# Altium schematic sheet Power.SchDoc
size A4; SheetNumber: 2; SheetTotal: 5
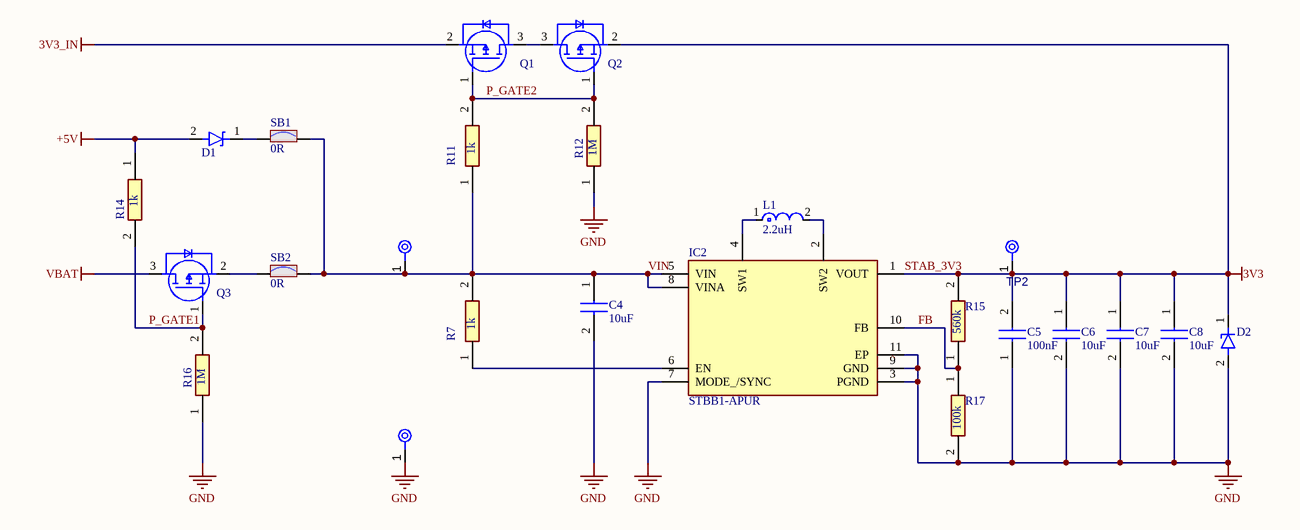
[diagram p0: Power.SchDoc]

## Parts
C4  10uF  [GRM18x]
C5  100nF  [CAPC1005X70N]
C6  10uF  [GRM18x]
C7  10uF  [GRM18x]
C8  10uF  [GRM18x]
D1  RB168MM-40TFTR  [RB168MM40TFTR]  (value not drawn)
D2  SP3205-01ETG  [SP320501ETG]  (value not drawn)
IC2  STBB1-APUR  [SON50P300X300X100-11N-D]
L1  2.2uH  [FP-XFL4020-MFG]
Q1  SSM3J358R,LF  [SOTFL95P240X88-3N]  (value not drawn)
Q2  SSM3J358R,LF  [SOTFL95P240X88-3N]  (value not drawn)
Q3  SSM3J358R,LF  [SOTFL95P240X88-3N]  (value not drawn)
R7  1k  [RESC1005X35N]
R11  1k  [RESC1005X35N]
R12  1M  [RESC1005X40N]
R14  1k  [RESC1005X35N]
R15  560k  [RESC1005X40N]
R16  1M  [RESC1005X40N]
R17  100k  [RESC1005X40N]
SB1  value 0R  [SOLDER-BRIDGE_R0603-0R]  (hidden comment: SB_ON)
SB2  value 0R  [SOLDER-BRIDGE_R0603-0R]  (hidden comment: SB_ON)
TP1  TPAD6R  [TP06R]  (value not drawn)  (no BOM)
TP2  TPAD6R  [TP06R]  (value not drawn)  (no BOM)
TP3  TPAD6R  [TP06R]  (value not drawn)  (no BOM)

## Nets
3V3_IN: Q1.2(S)
+5V: D1.2(A) R14.1
GND: C4.2 C5.1 C6.2 C7.2 C8.2 D2.2(A) IC2.3(PGND) IC2.7(MODE_/SYNC) IC2.9(GND) IC2.11(EP) R12.1 R16.1 R17.2 TP3.1(TP)
STAB_3V3: C5.2 C6.1 C7.1 C8.1 D2.1(K) IC2.1(VOUT) Q2.2(S) R15.2 TP2.1(TP)  [also labelled 3V3]
VBAT: Q3.3(D)
FB: IC2.10(FB) R15.1 R17.1
P_GATE1: Q3.1(G) R14.2 R16.2
P_GATE2: Q1.1(G) Q2.1(G) R11.2 R12.2
VIN: C4.1 IC2.5(VIN) IC2.8(VINA) R7.2 R11.1 SB1.2 SB2.2 TP1.1(TP)
NetD1_1: D1.1(K) SB1.1
NetIC2_2: IC2.2(SW2) L1.2
NetIC2_4: IC2.4(SW1) L1.1
NetIC2_6: IC2.6(EN) R7.1
NetQ1_3: Q1.3(D) Q2.3(D)
NetQ3_2: Q3.2(S) SB2.1

## Notes on the sheet
- Title:
- Date:
- Project:
- Type:
- Schematic
- Variant:
- Revision:
- Sheet
- of
- Author:
- Evžen Šteif
- Size:
- A4

## Library data of the parts
C4 C6-C8 = GRM188R61E106KA73D: Capacitor; Manufacturer_Name: Murata Electronics; Datasheet Link: https://search.murata.co.jp/Ceramy/image/img/A01X/G101/ENG/GRM188R61E106KA73-01A.pdf; Height: 0.9mm; Manufacturer_Part_Number: GRM188R61E106KA73D; Mouser Part Number: 81-GRM188R61E106KA3D; Mouser Price/Stock: https://www.mouser.co.uk/ProductDetail/Murata-Electronics/GRM188R61E106KA73D?qs=5aG0NVq1C4z8ebxPkQZf9A%3D%3D; Arrow Part Number: GRM188R61E106KA73D; Arrow Price/Stock: https://www.arrow.com/en/products/grm188r61e106ka73d/murata-manufacturing?region=nac
C5 = GRM155R61A104KA01D: Capacitor; Manufacturer_Name: Murata Electronics; Datasheet Link: https://search.murata.co.jp/Ceramy/image/img/A01X/G101/ENG/GRM155R61A104KA01-02A.pdf; Height: 0.7mm; Manufacturer_Part_Number: GRM155R61A104KA01D; Mouser Part Number: 81-GRM155R61A104KA01; Mouser Price/Stock: https://www.mouser.co.uk/ProductDetail/Murata-Electronics/GRM155R61A104KA01D?qs=5bAuhL3RhmNZw0v59AqOJA%3D%3D; Arrow Part Number: GRM155R61A104KA01D; Arrow Price/Stock: https://www.arrow.com/en/products/grm155r61a104ka01d/murata-manufacturing?utm_currency=USD&region=europe
D1 = RB168MM-40TFTR: Schottky Diode; Manufacturer_Name: ROHM Semiconductor; Datasheet Link: https://www.rohm.com/products/diodes/schottky-barrier-diodes/ultra-low-ir/rb168mm-40tf-product#productDetail; Height: 0.9mm; Manufacturer_Part_Number: RB168MM-40TFTR; Mouser Part Number: 755-RB168MM-40TFTR; Mouser Price/Stock: https://www.mouser.co.uk/ProductDetail/ROHM-Semiconductor/RB168MM-40TFTR?qs=4v%252BiZTmLVHGRj2i7xya%2FtQ%3D%3D
D2 = SP3205-01ETG: Diode ESD (Uni-directional); Manufacturer_Name: LITTELFUSE; Datasheet Link: https://4donline.ihs.com/images/VipMasterIC/IC/LFSI/LFSI-S-A0010724013/LFSI-S-A0010724013-1.pdf?hkey=6D3A4C79FDBF58556ACFDE234799DDF0; Height: 0.55mm; Manufacturer_Part_Number: SP3205-01ETG; Mouser Part Number: 576-SP3205-01ETG; Mouser Price/Stock: https://www.mouser.co.uk/ProductDetail/Littelfuse/SP3205-01ETG?qs=vHuUswq2%252BswfNhVD4WkB%252BQ%3D%3D; Arrow Part Number: SP3205-01ETG; Arrow Price/Stock: https://www.arrow.com/en/products/sp3205-01etg/littelfuse?utm_currency=USD&region=nac
IC2 = STBB1-APUR: Integrated Circuit; Manufacturer_Name: STMicroelectronics; Datasheet Link: https://www.st.com/resource/en/datasheet/stbb1-axx.pdf; Height: 1mm; Manufacturer_Part_Number: STBB1-APUR; Mouser Part Number: 511-STBB1-APUR; Mouser Price/Stock: https://www.mouser.co.uk/ProductDetail/STMicroelectronics/STBB1-APUR?qs=XoSzFQ8izGZfZqn873o0Mg%3D%3D; Arrow Part Number: STBB1-APUR; Arrow Price/Stock: https://www.arrow.com/en/products/stbb1-apur/stmicroelectronics?utm_currency=USD&region=nac
L1 = CMP-2000-05090-4: INDUCTOR, 2.2UH, 8A, 20%, 38MHZ, REEL; Test Frequency: 100kHz; Shielding: Shielded; Saturation Current: 3.1A; DC Resistance (DCR): 23.5mR; Core Material: Composite; Height: 2.1mm; Width: 4.3mm; Mount: Surface Mount; RMS Current (Irms): 8A; Case/Package: SMD/SMT; Length: 4.3mm; REACH SVHC: No SVHC; Max DC Current: 8A; Min Operating Temperature: -40°C; Series: XFL4020; Self Resonant Frequency: 38MHz; Inductance Tolerance: 20%; Lead Free: Contains Lead; Tolerance: 20%; RoHS Compliant: Yes; Termination: SMD/SMT; Packaging: Tape and Reel; Max Operating Temperature: 125°C; Inductance: 2.2uH
Q1-Q3 = SSM3J358R,LF: MOSFET (P-Channel); Manufacturer_Name: Toshiba; Datasheet Link: https://toshiba.semicon-storage.com/ap-en/product/mosfet/detail.SSM3J358R.html; Height: 0.88mm; Manufacturer_Part_Number: SSM3J358R,LF; Mouser Part Number: 757-SSM3J358RLF; Mouser Price/Stock: https://www.mouser.co.uk/ProductDetail/Toshiba/SSM3J358RLF?qs=HXFqYaX1Q2xwvCtt1GGmkw%3D%3D; Arrow Part Number: SSM3J358R,LF; Arrow Price/Stock: https://www.arrow.com/en/products/ssm3j358rlf/toshiba?region=nac
R7 R11 R14 = RT0402FRE071KL: Resistor; Manufacturer_Name: KEMET; Datasheet Link: https://www.yageo.com/upload/media/product/productsearch/datasheet/rchip/PYu-RT_1-to-0.01_RoHS_L_11.pdf; Height: 0.35mm; Manufacturer_Part_Number: RT0402FRE071KL; Mouser Part Number: RT0402FRE071KL; Mouser Price/Stock: https://www.mouser.co.uk/ProductDetail/YAGEO/RT0402FRE07100KL?qs=BXCcY9r%252B08CxTvf5JB1kiw%3D%3D; Arrow Part Number: RT0402FRE07100KL; Arrow Price/Stock: https://www.arrow.com/en/products/rt0402fre07100kl/yageo
R12 R16 = RC0402FR-071ML: Resistor; Manufacturer_Name: YAGEO; Datasheet Link: https://componentsearchengine.com/Datasheets/2/RC0402FR-071ML.pdf; Height: 0.4mm; Manufacturer_Part_Number: RC0402FR-071ML; Mouser Part Number: 603-RC0402FR-071ML; Mouser Price/Stock: https://www.mouser.co.uk/ProductDetail/YAGEO/RC0402FR-071ML?qs=V1yeUXFNrknfoI4987wfBQ%3D%3D; Arrow Part Number: RC0402FR-071ML; Arrow Price/Stock: https://www.arrow.com/en/products/rc0402fr-071ml/yageo?region=nac
R15 = RE0402BRE07560KL: Resistor; Manufacturer_Name: YAGEO; Datasheet Link: https://cz.mouser.com/datasheet/3/508/1/pyu-re_105_rohs_l.pdf; Height: 0.4mm; Manufacturer_Part_Number: RE0402BRE07560KL
R17 = RC0402BR-07100KL: Resistor; Manufacturer_Name: YAGEO; Datasheet Link: https://cz.mouser.com/datasheet/2/447/PYu_RC_Group_51_RoHS_L_12-3368608.pdf; Height: 0.4mm; Manufacturer_Part_Number: RC0402BR-07100KL
SB1 SB2 = MCD-00071: Resistor, 0R, SB0603, 5%, 0.1W; Manufacturer_Part_Number: RC0603JR-070RL; Manufacturer: YAGEO; Part_Preference: Recommended; Manufacturer_HQ_COO: Unknown; ShowFields: YES; ID: 2521; Order_Code_RS: 199-5647; Component_Country_Of_Origin: China; Internal_Part_Number: MCD-00071; Status: Released; Part_Type: Resistor; Package: 0603; ComponentLink1URL: http://tunmcdsvn.tun.st.com/Component_Documentation_Library/Trunk/Resistor/YAGEO_RC_Series; Order_Code_Digikey: 311-0.0GRTR-ND; Order_Code_Farnell: 2421846
TP1-TP3 = CMP-00028-00002-2: 0.6mm round; Pins: 1